# Altium project R3D903.PrjPCB
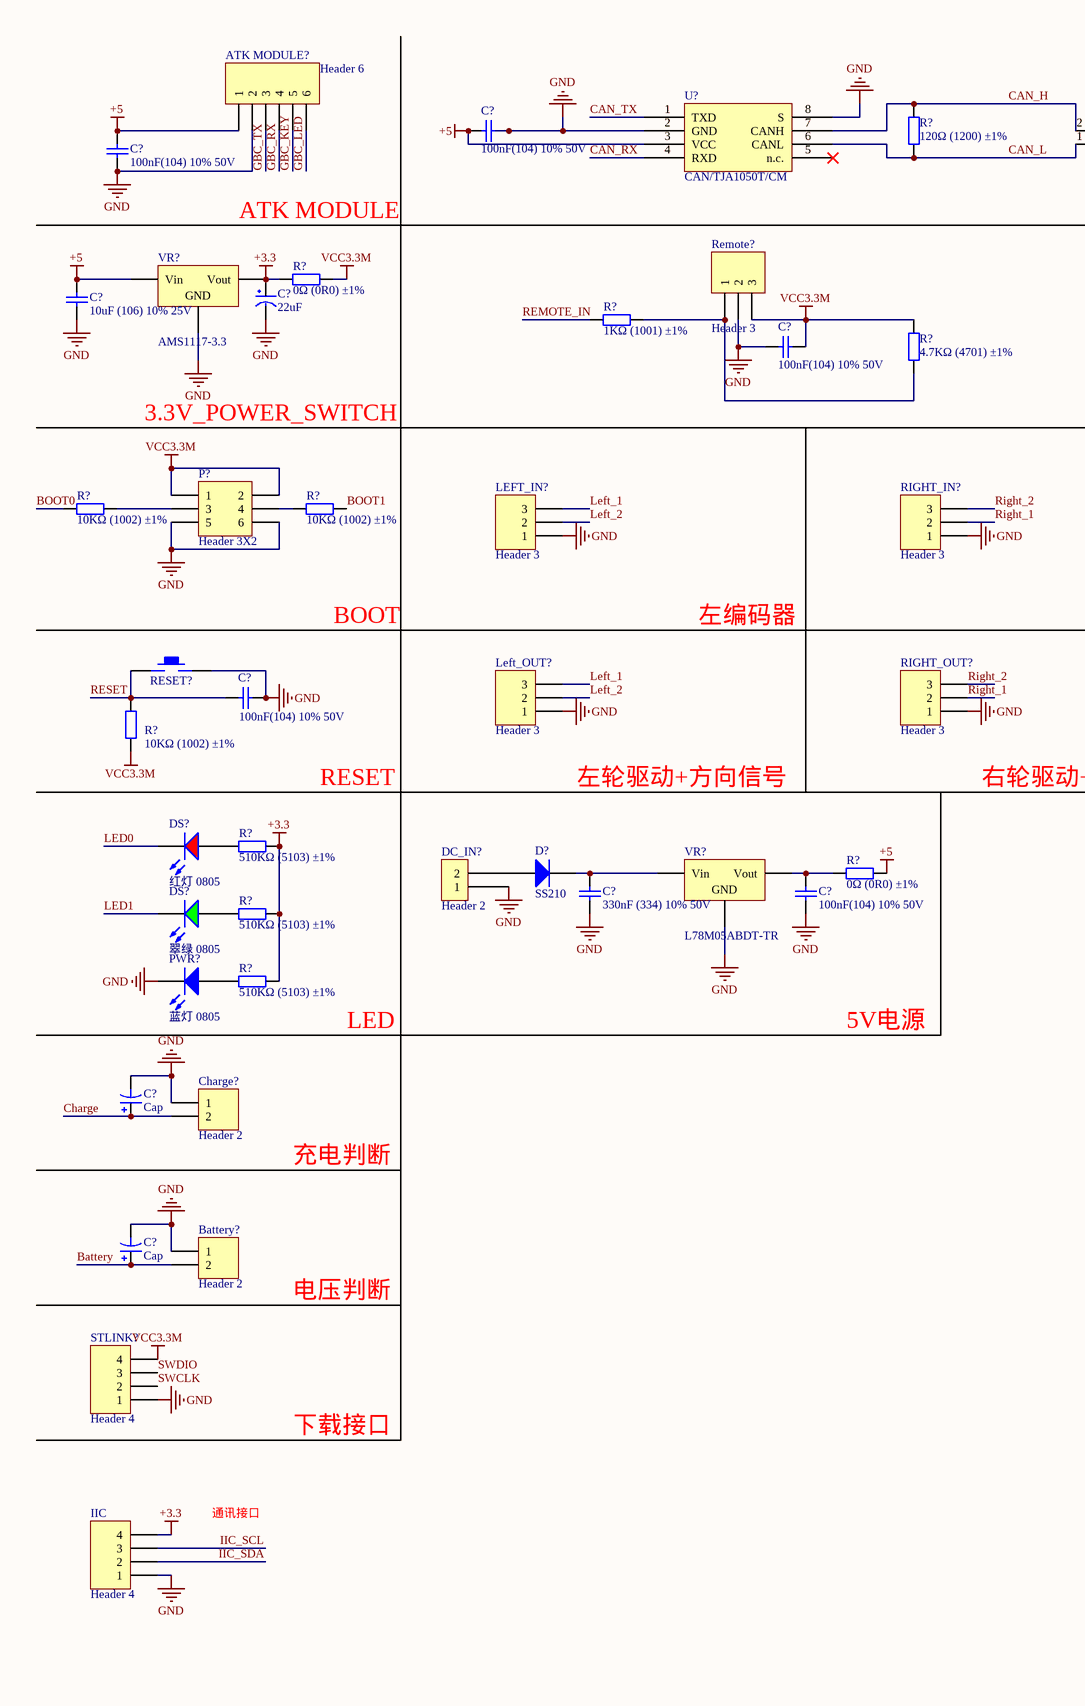
[diagram p0: D3R903.SchDoc, left]
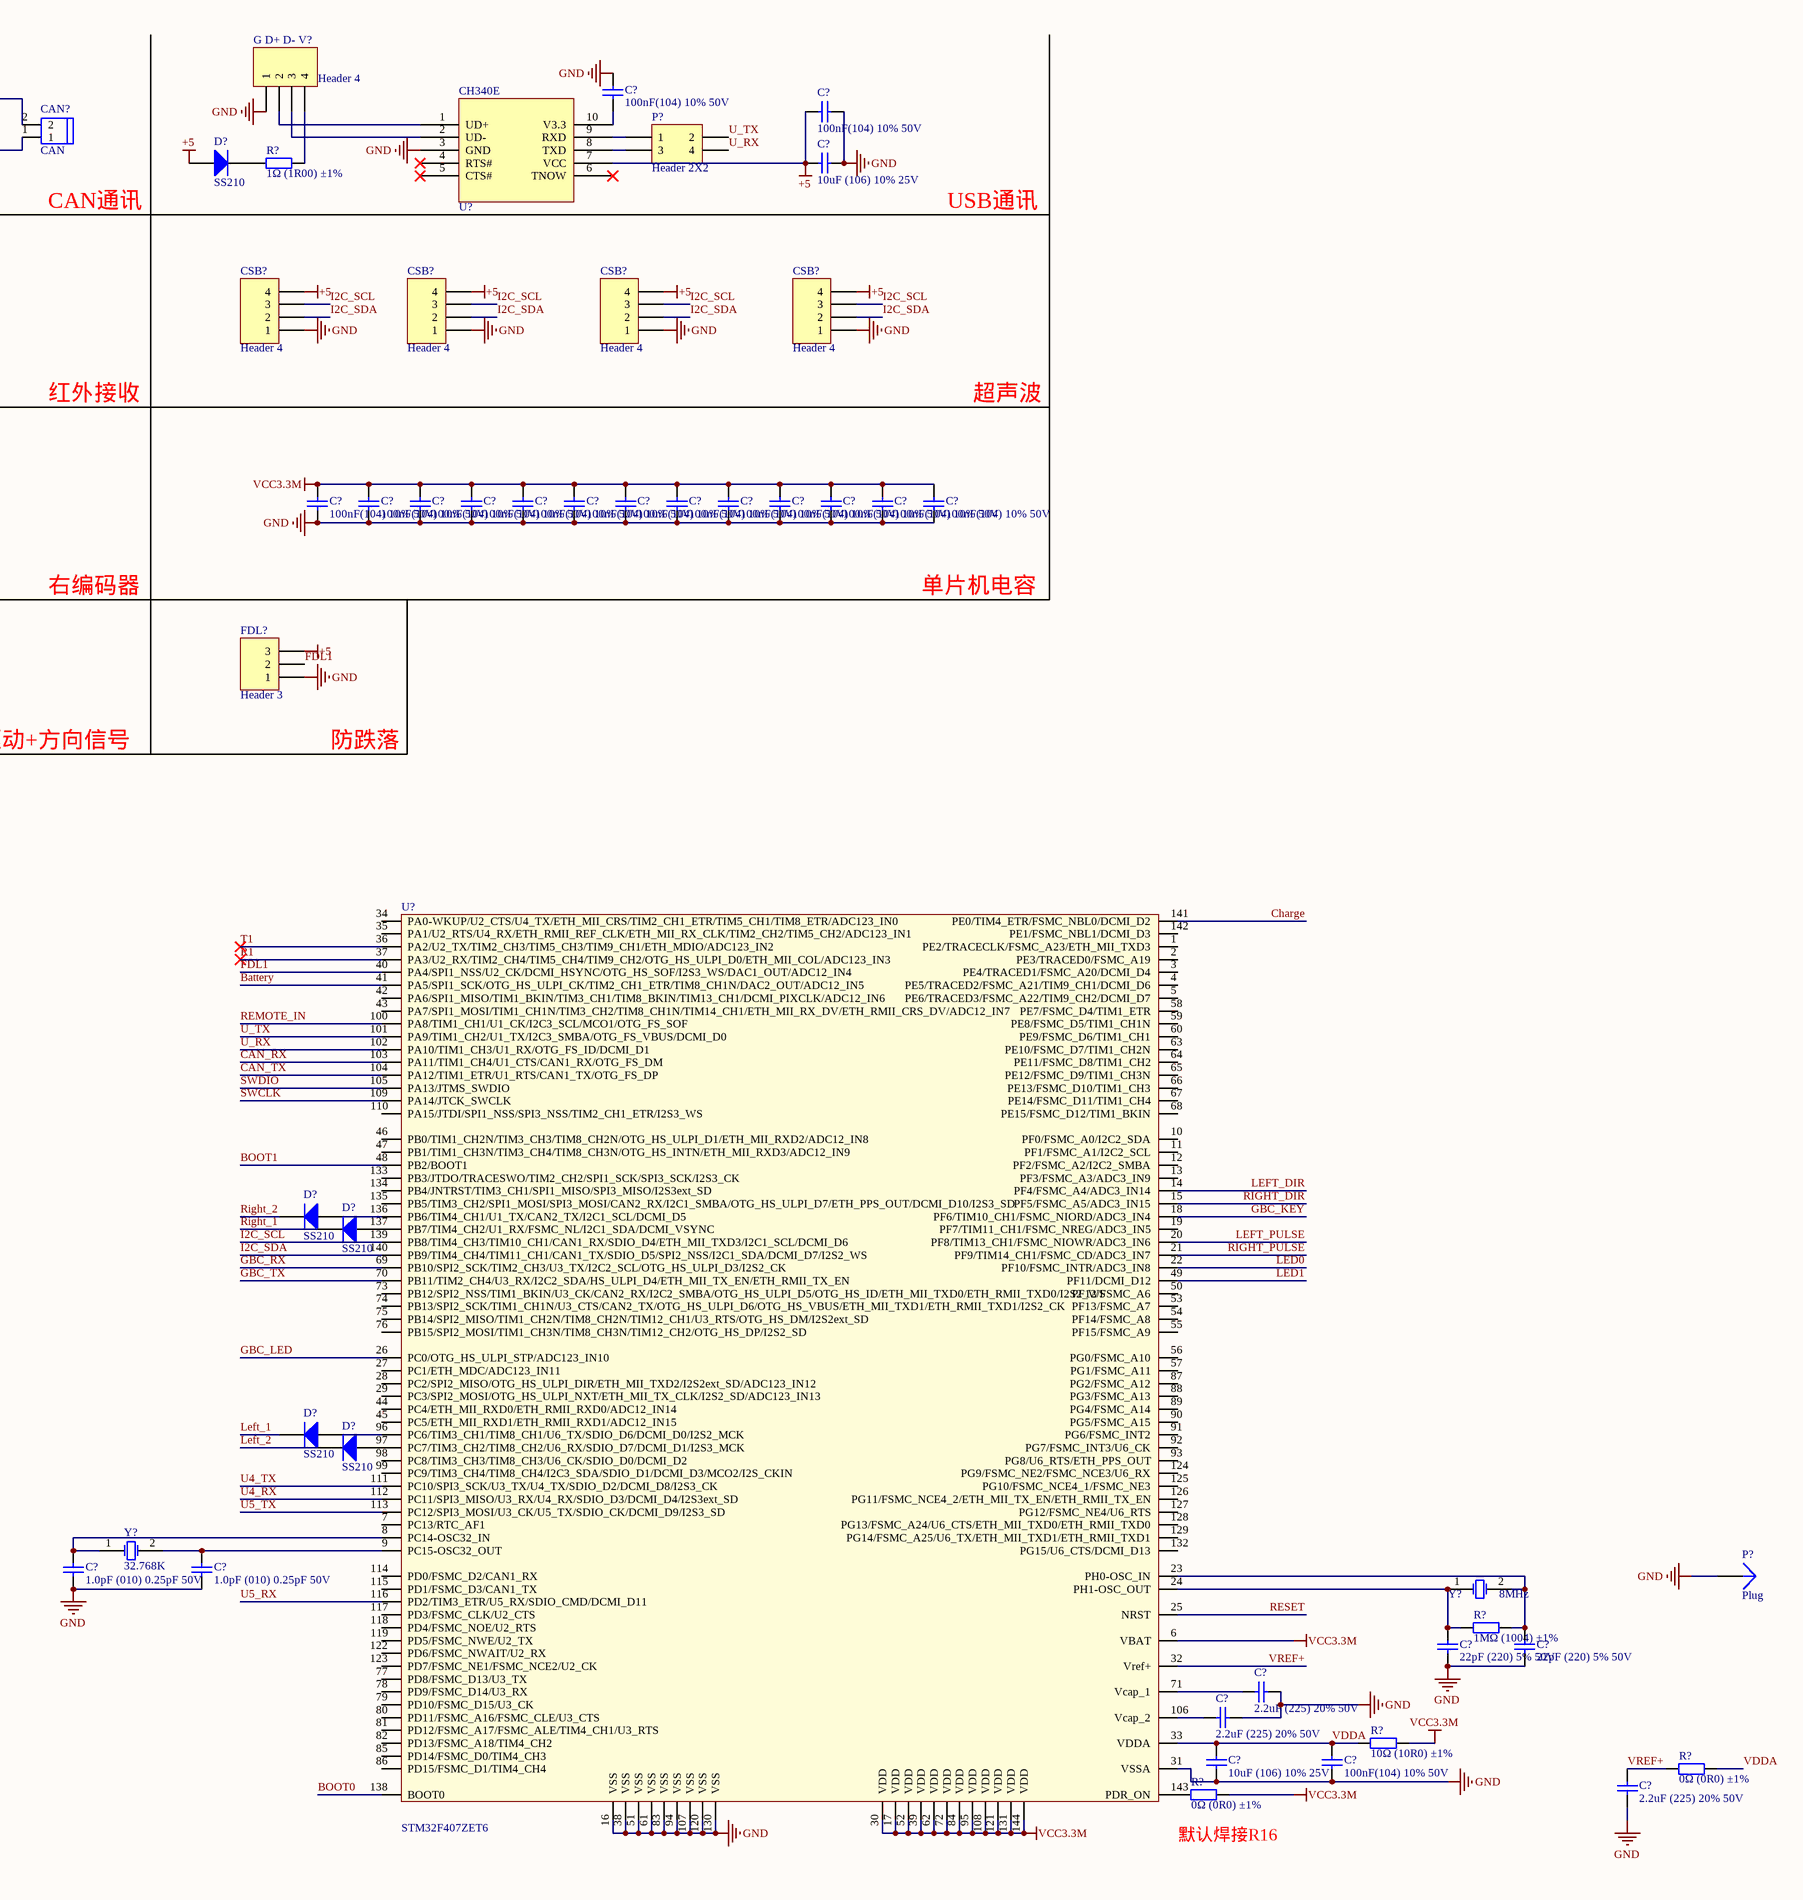
[diagram p1: D3R903.SchDoc, right]
1 sheet, 89 parts. Net scope: global (net labels, ports and power ports of the same name join across sheets).
Board file: R3D902.PcbDoc

## Sheet D3R903.SchDoc
size A1

### Parts
(Parts that share a designator on the sheet are numbered #1, #2 ... from top to bottom, then left to right.)
ATK_MODULE?  Header 6  [HDR1X6]
Battery?  Header 2  [HDR1X2]
C?#1  100nF(104) 10% 50V  [LC-0805_C]
C?#2  100nF(104) 10% 50V  [LC-0805_C]
C?#3  100nF(104) 10% 50V  [LC-0805_C]
C?#4  10uF (106) 10% 25V  [LC-0805_C]
C?#5  100nF(104) 10% 50V  [LC-0805_C]
C?#6  22uF  [CC6.56.5]
C?#7  10uF (106) 10% 25V  [LC-0805_C]
C?#8  100nF(104) 10% 50V  [LC-0805_C]
C?#9  100nF(104) 10% 50V  [LC-0805_C]
C?#10  100nF(104) 10% 50V  [LC-0805_C]
C?#11  100nF(104) 10% 50V  [LC-0805_C]
C?#12  100nF(104) 10% 50V  [LC-0805_C]
C?#13  100nF(104) 10% 50V  [LC-0805_C]
C?#14  100nF(104) 10% 50V  [LC-0805_C]
C?#15  100nF(104) 10% 50V  [LC-0805_C]
C?#16  100nF(104) 10% 50V  [LC-0805_C]
C?#17  100nF(104) 10% 50V  [LC-0805_C]
C?#18  100nF(104) 10% 50V  [LC-0805_C]
C?#19  100nF(104) 10% 50V  [LC-0805_C]
C?#20  100nF(104) 10% 50V  [LC-0805_C]
C?#21  100nF(104) 10% 50V  [LC-0805_C]
C?#22  100nF(104) 10% 50V  [LC-0805_C]
C?#23  330nF (334) 10% 50V  [LC-0805_C]
C?#24  100nF(104) 10% 50V  [LC-0805_C]
C?#25  Cap  [CAP-DIP-3.5]
C?#26  Cap  [CAP-DIP-3.5]
C?#27  1.0pF (010) 0.25pF 50V  [LC-0805_C]
C?#28  1.0pF (010) 0.25pF 50V  [LC-0805_C]
C?#29  2.2uF (225) 20% 50V  [LC-0805_C]
C?#30  22pF (220) 5% 50V  [LC-0805_C]
C?#31  22pF (220) 5% 50V  [LC-0805_C]
C?#32  2.2uF (225) 20% 50V  [LC-0805_C]
C?#33  10uF (106) 10% 25V  [LC-0805_C]
C?#34  100nF(104) 10% 50V  [LC-0805_C]
C?#35  2.2uF (225) 20% 50V  [LC-0805_C]
CAN?  CAN  [HEAD2L-0.8]
Charge?  Header 2  [HDR1X2]
CSB?#1  Header 4  [HDR1X4]
CSB?#2  Header 4  [HDR1X4]
CSB?#3  Header 4  [HDR1X4]
CSB?#4  Header 4  [HDR1X4]
D?#1  SS210  [LC-SMA(DO-214AC)_S1]
D?#2  SS210  [LC-SMA(DO-214AC)_S1]
D?#3  SS210  [LC-SMA(DO-214AC)_S1]
D?#4  SS210  [LC-SMA(DO-214AC)_S1]
D?#5  SS210  [LC-SMA(DO-214AC)_S1]
D?#6  SS210  [LC-SMA(DO-214AC)_S1]
DC_IN?  Header 2  [VH-2A - Circle Hole]
DS?#1  红灯 0805  [LC-0805_LED_S1]
DS?#2  翠绿 0805  [LC-0805_LED_S1]
FDL?  Header 3  [HDR1X3]
G_D+_D-_V?  Header 4  [HDR1X4]
IIC  Header 4  [HDR1X4]
LEFT_IN?  Header 3  [HDR1X3]
Left_OUT?  Header 3  [HDR1X3]
P?#1  Header 2X2  [HDR2X2]
P?#2  Header 3X2  [HDR2X3]
P?#3  Plug  [PIN1]
PWR?  蓝灯 0805  [LC-0805_LED_S1]
R?#1  120Ω (1200) ±1%  [LC-0805_R]
R?#2  1Ω (1R00) ±1%  [LC-0603_R]
R?#3  0Ω (0R0) ±1%  [LC-0603_R]
R?#4  1KΩ (1001) ±1%  [LC-0805_R]
R?#5  4.7KΩ (4701) ±1%  [LC-0805_R]
R?#6  10KΩ (1002) ±1%  [LC-0805_R]
R?#7  10KΩ (1002) ±1%  [LC-0805_R]
R?#8  10KΩ (1002) ±1%  [LC-0805_R]
R?#9  510KΩ (5103) ±1%  [LC-0805_R]
R?#10  0Ω (0R0) ±1%  [LC-0603_R]
R?#11  510KΩ (5103) ±1%  [LC-0805_R]
R?#12  510KΩ (5103) ±1%  [LC-0805_R]
R?#13  1MΩ (1004) ±1%  [LC-0805_R]
R?#14  10Ω (10R0) ±1%  [LC-0805_R]
R?#15  0Ω (0R0) ±1%  [LC-0603_R]
R?#16  0Ω (0R0) ±1%  [LC-0603_R]
Remote?  Header 3  [HDR1X3]
RESET?  KEY_M  [KEY_M]  (value not drawn)
RIGHT_IN?  Header 3  [HDR1X3]
RIGHT_OUT?  Header 3  [HDR1X3]
STLINK?  Header 4  [HDR1X4]
U?#1  CAN/TJA1050T/CM  [LC-SOIC-8_150mil]
U?#2  CH340E  [LC-MSOP-10]  (value not drawn)
U?#3  STM32F407ZET6  [LQFP144]
VR?#1  AMS1117-3.3  [LC-SOT-223]
VR?#2  L78M05ABDT-TR  [LC-TO-252-2-180]
Y?#1  32.768K  [R38]
Y?#2  8MHz  [XTAL_US]

### Nets
+3.3: C?#6.1(VCC) IIC.4 R?#3.1 R?#9.2 R?#11.2 R?#12.2 VR?#1.2(Vout)
+5: ATK_MODULE?.1 C?#1.1 C?#2.1 C?#4.1 C?#5.2 C?#7.2 CSB?#1.4 CSB?#2.4 CSB?#3.4 CSB?#4.4 D?#1.1(A) FDL?.3 R?#10.2 U?#1.3(VCC) U?#2.7(VCC) VR?#1.3(Vin)
GND: ATK_MODULE?.2 Battery?.1 C?#1.2 C?#2.2 C?#3.2 C?#4.2 C?#5.1 C?#6.2(GND) C?#7.1 C?#8.1 C?#9.2 C?#10.2 C?#11.2 C?#12.2 C?#13.2 C?#14.2 C?#15.2 C?#16.2 C?#17.2 C?#18.2 C?#19.2 C?#20.2 C?#21.2 C?#22.1 C?#23.1 C?#24.1 C?#25.2 C?#26.2 C?#27.1 C?#28.1 C?#29.2 C?#30.1 C?#31.1 C?#32.2 C?#33.1 C?#34.1 C?#35.1 Charge?.1 CSB?#1.1 CSB?#2.1 CSB?#3.1 CSB?#4.1 DC_IN?.1 FDL?.1 G_D+_D-_V?.1 IIC.1 LEFT_IN?.1 Left_OUT?.1 P?#2.5 P?#2.6 P?#3.1 PWR?.K Remote?.2 RESET?.2 RIGHT_IN?.1 RIGHT_OUT?.1 STLINK?.1 U?#1.2(GND) U?#1.8(S) U?#2.3(GND) U?#3.16(VSS) U?#3.31(VSSA) U?#3.38(VSS) U?#3.51(VSS) U?#3.61(VSS) U?#3.83(VSS) U?#3.94(VSS) U?#3.107(VSS) U?#3.120(VSS) U?#3.130(VSS) VR?#1.1(GND) VR?#2.2(GND)
VCC3.3M: C?#8.2 C?#9.1 C?#10.1 C?#11.1 C?#12.1 C?#13.1 C?#14.1 C?#15.1 C?#16.1 C?#17.1 C?#18.1 C?#19.1 C?#20.1 C?#21.1 P?#2.1 P?#2.2 R?#3.2 R?#5.2 R?#8.1 R?#14.2 R?#16.2 Remote?.3 STLINK?.4 U?#3.6(VBAT) U?#3.17(VDD) U?#3.30(VDD) U?#3.39(VDD) U?#3.52(VDD) U?#3.62(VDD) U?#3.72(VDD) U?#3.84(VDD) U?#3.95(VDD) U?#3.108(VDD) U?#3.121(VDD) U?#3.131(VDD) U?#3.144(VDD)
Battery: Battery?.2 C?#26.1 U?#3.41(PA5/SPI1_SCK/OTG_HS_ULPI_CK/TIM2_CH1_ETR/TIM8_CH1N/DAC2_OUT/ADC12_IN5)
BOOT0: R?#6.1 U?#3.138(BOOT0)
BOOT1: R?#7.2 U?#3.48(PB2/BOOT1)
CAN_H: CAN?.2 R?#1.2 U?#1.7(CANH)
CAN_L: CAN?.1 R?#1.1 U?#1.6(CANL)
CAN_RX: U?#1.4(RXD) U?#3.103(PA11/TIM1_CH4/U1_CTS/CAN1_RX/OTG_FS_DM)
CAN_TX: U?#1.1(TXD) U?#3.104(PA12/TIM1_ETR/U1_RTS/CAN1_TX/OTG_FS_DP)
Charge: C?#25.1 Charge?.2 U?#3.141(PE0/TIM4_ETR/FSMC_NBL0/DCMI_D2)
FDL1: FDL?.2 U?#3.40(PA4/SPI1_NSS/U2_CK/DCMI_HSYNC/OTG_HS_SOF/I2S3_WS/DAC1_OUT/ADC12_IN4)
GBC_KEY: ATK_MODULE?.5 U?#3.18(PF6/TIM10_CH1/FSMC_NIORD/ADC3_IN4)
GBC_LED: ATK_MODULE?.6 U?#3.26(PC0/OTG_HS_ULPI_STP/ADC123_IN10)
GBC_RX: ATK_MODULE?.4 U?#3.69(PB10/SPI2_SCK/TIM2_CH3/U3_TX/I2C2_SCL/OTG_HS_ULPI_D3/I2S2_CK)
GBC_TX: ATK_MODULE?.3 U?#3.70(PB11/TIM2_CH4/U3_RX/I2C2_SDA/HS_ULPI_D4/ETH_MII_TX_EN/ETH_RMII_TX_EN)
I2C_SCL: CSB?#1.3 CSB?#2.3 CSB?#3.3 CSB?#4.3 U?#3.139(PB8/TIM4_CH3/TIM10_CH1/CAN1_RX/SDIO_D4/ETH_MII_TXD3/I2C1_SCL/DCMI_D6)
I2C_SDA: CSB?#1.2 CSB?#2.2 CSB?#3.2 CSB?#4.2 U?#3.140(PB9/TIM4_CH4/TIM11_CH1/CAN1_TX/SDIO_D5/SPI2_NSS/I2C1_SDA/DCMI_D7/I2S2_WS)
IIC_SCL: IIC.3
IIC_SDA: IIC.2
LED0: DS?#1.K U?#3.22(PF10/FSMC_INTR/ADC3_IN8)
LED1: DS?#2.K U?#3.49(PF11/DCMI_D12)
Left_1: D?#5.2(K) LEFT_IN?.3 Left_OUT?.3
Left_2: D?#6.2(K) LEFT_IN?.2 Left_OUT?.2
LEFT_DIR: U?#3.14(PF4/FSMC_A4/ADC3_IN14)
LEFT_PULSE: U?#3.20(PF8/TIM13_CH1/FSMC_NIOWR/ADC3_IN6)
R1: U?#3.37(PA3/U2_RX/TIM2_CH4/TIM5_CH4/TIM9_CH2/OTG_HS_ULPI_D0/ETH_MII_COL/ADC123_IN3)
REMOTE_IN: R?#4.1 U?#3.100(PA8/TIM1_CH1/U1_CK/I2C3_SCL/MCO1/OTG_FS_SOF)
RESET: C?#22.2 R?#8.2 RESET?.1 U?#3.25(NRST)
Right_1: D?#4.2(K) RIGHT_IN?.2 RIGHT_OUT?.2
Right_2: D?#3.2(K) RIGHT_IN?.3 RIGHT_OUT?.3
RIGHT_DIR: U?#3.15(PF5/FSMC_A5/ADC3_IN15)
RIGHT_PULSE: U?#3.21(PF9/TIM14_CH1/FSMC_CD/ADC3_IN7)
SWCLK: STLINK?.2 U?#3.109(PA14/JTCK_SWCLK)
SWDIO: STLINK?.3 U?#3.105(PA13/JTMS_SWDIO)
T1: U?#3.36(PA2/U2_TX/TIM2_CH3/TIM5_CH3/TIM9_CH1/ETH_MDIO/ADC123_IN2)
U4_RX: U?#3.112(PC11/SPI3_MISO/U3_RX/U4_RX/SDIO_D3/DCMI_D4/I2S3ext_SD)
U4_TX: U?#3.111(PC10/SPI3_SCK/U3_TX/U4_TX/SDIO_D2/DCMI_D8/I2S3_CK)
U5_RX: U?#3.116(PD2/TIM3_ETR/U5_RX/SDIO_CMD/DCMI_D11)
U5_TX: U?#3.113(PC12/SPI3_MOSI/U3_CK/U5_TX/SDIO_CK/DCMI_D9/I2S3_SD)
U_RX: P?#1.4 U?#3.102(PA10/TIM1_CH3/U1_RX/OTG_FS_ID/DCMI_D1)
U_TX: P?#1.2 U?#3.101(PA9/TIM1_CH2/U1_TX/I2C3_SMBA/OTG_FS_VBUS/DCMI_D0)
VDDA: C?#33.2 C?#34.2 R?#14.1 R?#15.2 U?#3.33(VDDA)
VREF+: C?#35.2 R?#15.1 U?#3.32(Vref+)
NetC?#3_1: C?#3.1 U?#2.10(V3.3)
NetC?#23_2: C?#23.2 D?#2.2(K) VR?#2.1(Vin)
NetC?#24_2: C?#24.2 R?#10.1 VR?#2.3(Vout)
NetC?#27_2: C?#27.2 U?#3.8(PC14-OSC32_IN) Y?#1.1(OSC1)
NetC?#28_2: C?#28.2 U?#3.9(PC15-OSC32_OUT) Y?#1.2(OSC2)
NetC?#29_1: C?#29.1 U?#3.71(Vcap_1)
NetC?#30_2: C?#30.2 R?#13.1 U?#3.24(PH1-OSC_OUT) Y?#2.1(OSC1)
NetC?#31_2: C?#31.2 R?#13.2 U?#3.23(PH0-OSC_IN) Y?#2.2(OSC2)
NetC?#32_1: C?#32.1 U?#3.106(Vcap_2)
NetD?#1_2: D?#1.2(K) R?#2.1
NetD?#2_1: D?#2.1(A) DC_IN?.2
NetD?#3_1: D?#3.1(A) U?#3.136(PB6/TIM4_CH1/U1_TX/CAN2_TX/I2C1_SCL/DCMI_D5)
NetD?#4_1: D?#4.1(A) U?#3.137(PB7/TIM4_CH2/U1_RX/FSMC_NL/I2C1_SDA/DCMI_VSYNC)
NetD?#5_1: D?#5.1(A) U?#3.96(PC6/TIM3_CH1/TIM8_CH1/U6_TX/SDIO_D6/DCMI_D0/I2S2_MCK)
NetD?#6_1: D?#6.1(A) U?#3.97(PC7/TIM3_CH2/TIM8_CH2/U6_RX/SDIO_D7/DCMI_D1/I2S3_MCK)
NetDS?#1_A: DS?#1.A R?#9.1
NetDS?#2_A: DS?#2.A R?#11.1
NetG_D+_D-_V?_2: G_D+_D-_V?.2 U?#2.1(UD+)
NetG_D+_D-_V?_3: G_D+_D-_V?.3 U?#2.2(UD-)
NetG_D+_D-_V?_4: G_D+_D-_V?.4 R?#2.2
NetP?#1_1: P?#1.1 U?#2.9(RXD)
NetP?#1_3: P?#1.3 U?#2.8(TXD)
NetP?#2_3: P?#2.3 R?#6.2
NetP?#2_4: P?#2.4 R?#7.1
NetPWR?_A: PWR?.A R?#12.1
NetR?#4_2: R?#4.2 R?#5.1 Remote?.1
NetR?#16_1: R?#16.1 U?#3.143(PDR_ON)

Not connected (* = marked no-connect by the designer): U?#1 5(n.c.)*; U?#2 4(RTS#)* 5(CTS#)* 6(TNOW)*; U?#3 1(PE2/TRACECLK/FSMC_A23/ETH_MII_TXD3) 2(PE3/TRACED0/FSMC_A19) 3(PE4/TRACED1/FSMC_A20/DCMI_D4) 4(PE5/TRACED2/FSMC_A21/TIM9_CH1/DCMI_D6) 5(PE6/TRACED3/FSMC_A22/TIM9_CH2/DCMI_D7) 7(PC13/RTC_AF1) 10(PF0/FSMC_A0/I2C2_SDA) 11(PF1/FSMC_A1/I2C2_SCL) 12(PF2/FSMC_A2/I2C2_SMBA) 13(PF3/FSMC_A3/ADC3_IN9) 19(PF7/TIM11_CH1/FSMC_NREG/ADC3_IN5) 27(PC1/ETH_MDC/ADC123_IN11) 28(PC2/SPI2_MISO/OTG_HS_ULPI_DIR/ETH_MII_TXD2/I2S2ext_SD/ADC123_IN12) 29(PC3/SPI2_MOSI/OTG_HS_ULPI_NXT/ETH_MII_TX_CLK/I2S2_SD/ADC123_IN13) 34(PA0-WKUP/U2_CTS/U4_TX/ETH_MII_CRS/TIM2_CH1_ETR/TIM5_CH1/TIM8_ETR/ADC123_IN0) 35(PA1/U2_RTS/U4_RX/ETH_RMII_REF_CLK/ETH_MII_RX_CLK/TIM2_CH2/TIM5_CH2/ADC123_IN1) 42(PA6/SPI1_MISO/TIM1_BKIN/TIM3_CH1/TIM8_BKIN/TIM13_CH1/DCMI_PIXCLK/ADC12_IN6) 43(PA7/SPI1_MOSI/TIM1_CH1N/TIM3_CH2/TIM8_CH1N/TIM14_CH1/ETH_MII_RX_DV/ETH_RMII_CRS_DV/ADC12_IN7) 44(PC4/ETH_MII_RXD0/ETH_RMII_RXD0/ADC12_IN14) 45(PC5/ETH_MII_RXD1/ETH_RMII_RXD1/ADC12_IN15) 46(PB0/TIM1_CH2N/TIM3_CH3/TIM8_CH2N/OTG_HS_ULPI_D1/ETH_MII_RXD2/ADC12_IN8) 47(PB1/TIM1_CH3N/TIM3_CH4/TIM8_CH3N/OTG_HS_INTN/ETH_MII_RXD3/ADC12_IN9) 50(PF12/FSMC_A6) 53(PF13/FSMC_A7) 54(PF14/FSMC_A8) 55(PF15/FSMC_A9) 56(PG0/FSMC_A10) 57(PG1/FSMC_A11) 58(PE7/FSMC_D4/TIM1_ETR) 59(PE8/FSMC_D5/TIM1_CH1N) 60(PE9/FSMC_D6/TIM1_CH1) 63(PE10/FSMC_D7/TIM1_CH2N) 64(PE11/FSMC_D8/TIM1_CH2) 65(PE12/FSMC_D9/TIM1_CH3N) 66(PE13/FSMC_D10/TIM1_CH3) 67(PE14/FSMC_D11/TIM1_CH4) 68(PE15/FSMC_D12/TIM1_BKIN) 73(PB12/SPI2_NSS/TIM1_BKIN/U3_CK/CAN2_RX/I2C2_SMBA/OTG_HS_ULPI_D5/OTG_HS_ID/ETH_MII_TXD0/ETH_RMII_TXD0/I2S2_WS) 74(PB13/SPI2_SCK/TIM1_CH1N/U3_CTS/CAN2_TX/OTG_HS_ULPI_D6/OTG_HS_VBUS/ETH_MII_TXD1/ETH_RMII_TXD1/I2S2_CK) 75(PB14/SPI2_MISO/TIM1_CH2N/TIM8_CH2N/TIM12_CH1/U3_RTS/OTG_HS_DM/I2S2ext_SD) 76(PB15/SPI2_MOSI/TIM1_CH3N/TIM8_CH3N/TIM12_CH2/OTG_HS_DP/I2S2_SD) 77(PD8/FSMC_D13/U3_TX) 78(PD9/FSMC_D14/U3_RX) 79(PD10/FSMC_D15/U3_CK) 80(PD11/FSMC_A16/FSMC_CLE/U3_CTS) 81(PD12/FSMC_A17/FSMC_ALE/TIM4_CH1/U3_RTS) 82(PD13/FSMC_A18/TIM4_CH2) 85(PD14/FSMC_D0/TIM4_CH3) 86(PD15/FSMC_D1/TIM4_CH4) 87(PG2/FSMC_A12) 88(PG3/FSMC_A13) 89(PG4/FSMC_A14) 90(PG5/FSMC_A15) 91(PG6/FSMC_INT2) 92(PG7/FSMC_INT3/U6_CK) 93(PG8/U6_RTS/ETH_PPS_OUT) 98(PC8/TIM3_CH3/TIM8_CH3/U6_CK/SDIO_D0/DCMI_D2) 99(PC9/TIM3_CH4/TIM8_CH4/I2C3_SDA/SDIO_D1/DCMI_D3/MCO2/I2S_CKIN) 110(PA15/JTDI/SPI1_NSS/SPI3_NSS/TIM2_CH1_ETR/I2S3_WS) 114(PD0/FSMC_D2/CAN1_RX) 115(PD1/FSMC_D3/CAN1_TX) 117(PD3/FSMC_CLK/U2_CTS) 118(PD4/FSMC_NOE/U2_RTS) 119(PD5/FSMC_NWE/U2_TX) 122(PD6/FSMC_NWAIT/U2_RX) 123(PD7/FSMC_NE1/FSMC_NCE2/U2_CK) 124(PG9/FSMC_NE2/FSMC_NCE3/U6_RX) 125(PG10/FSMC_NCE4_1/FSMC_NE3) 126(PG11/FSMC_NCE4_2/ETH_MII_TX_EN/ETH_RMII_TX_EN) 127(PG12/FSMC_NE4/U6_RTS) 128(PG13/FSMC_A24/U6_CTS/ETH_MII_TXD0/ETH_RMII_TXD0) 129(PG14/FSMC_A25/U6_TX/ETH_MII_TXD1/ETH_RMII_TXD1) 132(PG15/U6_CTS/DCMI_D13) 133(PB3/JTDO/TRACESWO/TIM2_CH2/SPI1_SCK/SPI3_SCK/I2S3_CK) 134(PB4/JNTRST/TIM3_CH1/SPI1_MISO/SPI3_MISO/I2S3ext_SD) 135(PB5/TIM3_CH2/SPI1_MOSI/SPI3_MOSI/CAN2_RX/I2C1_SMBA/OTG_HS_ULPI_D7/ETH_PPS_OUT/DCMI_D10/I2S3_SD) 142(PE1/FSMC_NBL1/DCMI_D3)

### Notes on the sheet
- ATK MODULE
- CAN通讯
- USB通讯
- 3.3V_POWER_SWITCH
- 红外接收
- 超声波
- BOOT
- 左编码器
- 右编码器
- 单片机电容
- RESET
- 左轮驱动+方向信号
- 右轮驱动+方向信号
- 防跌落
- LED
- 5V电源
- 充电判断
- 电压判断
- 下载接口
- 通讯接口
- 默认焊接R16
- Title
- Size:
- Date:
- File:
- A1
- Number:
- Time:
- Revision:
- Sheet
- of

### Library data of the parts
ATK_MODULE? = Header 6: Header, 6-Pin; LatestRevisionDate: 17-Jul-2002; LatestRevisionNote: Re-released for DXP Platform.; Publisher: Altium Limited
Battery? Charge? = Header 2: Header, 2-Pin; LatestRevisionDate: 17-Jul-2002; LatestRevisionNote: Re-released for DXP Platform.; Publisher: Altium Limited
C?#1-C?#3 C?#5 C?#8-C?#22 C?#24 C?#34 = 0805 100nF(104) 10% 50V: 贴片电容; ComponentLink1Description: 供应商链接; ComponentLink1URL: http://www.szlcsc.com/product/details_50686.html; Package: 0805; Supplier: LC; SuppliersPartNumber: C49678
C?#4 C?#7 C?#33 = 0805 10uF (106) 10% 25V: 贴片电容; ComponentLink1Description: 供应商链接; ComponentLink1URL: http://www.szlcsc.com/product/details_16532.html; Package: 0805; Supplier: LC; SuppliersPartNumber: C15850
C?#6 = CAP
C?#23 = 0805 330nF (334) 10% 50V: 贴片电容; ComponentLink1Description: 供应商链接; ComponentLink1URL: http://www.szlcsc.com/product/details_2092.html; Package: 0805; Supplier: LC; SuppliersPartNumber: C1740
C?#25 C?#26 = Cap_DIP
C?#27 C?#28 = 0805 1.0pF (010) 0.25pF 50V: 贴片电容; ComponentLink1Description: 供应商链接; ComponentLink1URL: http://www.szlcsc.com/product/details_15644.html; Package: 0805; Supplier: LC; SuppliersPartNumber: C14971
C?#29 C?#32 C?#35 = 0805 2.2uF (225) 20% 50V: 贴片电容; ComponentLink1Description: 供应商链接; ComponentLink1URL: http://www.szlcsc.com/product/details_50225.html; Package: 0805; Supplier: LC; SuppliersPartNumber: C49217
C?#30 C?#31 = 0805 22pF (220) 5% 50V: 贴片电容; ComponentLink1Description: 供应商链接; ComponentLink1URL: http://www.szlcsc.com/product/details_2156.html; Package: 0805; Supplier: LC; SuppliersPartNumber: C1804
CAN? = HEAD2
CSB?#1-CSB?#4 G_D+_D-_V? IIC STLINK? = Header 4: Header, 4-Pin; LatestRevisionDate: 17-Jul-2002; LatestRevisionNote: Re-released for DXP Platform.; Publisher: Altium Limited
D?#1-D?#6 = SMA(DO-214AC) SS210: 二极管; ComponentLink1Description: 供应商链接; ComponentLink1URL: http://www.szlcsc.com/product/details_15669.html; Package: SMA(DO-214AC); Supplier: LC; SuppliersPartNumber: C14996
DC_IN? = Header 2: 贴片2p座
DS?#1 = 0805 红灯: 发光二极管; ComponentLink1Description: 供应商链接; ComponentLink1URL: http://www.szlcsc.com/product/details_2668.html; Package: 0805; Supplier: LC; SuppliersPartNumber: C2295
DS?#2 = 0805 翠绿: 发光二极管; ComponentLink1Description: 供应商链接; ComponentLink1URL: http://www.szlcsc.com/product/details_2670.html; Package: 0805; Supplier: LC; SuppliersPartNumber: C2297
FDL? LEFT_IN? Left_OUT? Remote? RIGHT_IN? RIGHT_OUT? = Header 3: Header, 3-Pin; LatestRevisionDate: 17-Jul-2002; LatestRevisionNote: Re-released for DXP Platform.; Publisher: Altium Limited
P?#1 = Header 2X2: Header, 2-Pin, Dual row; LatestRevisionDate: 17-Jul-2002; LatestRevisionNote: Re-released for DXP Platform.; Publisher: Altium Limited
P?#2 = Header 3X2: Header, 3-Pin, Dual row; LatestRevisionDate: 17-Jul-2002; LatestRevisionNote: Re-released for DXP Platform.; Publisher: Altium Limited
PWR? = 0805 蓝灯: 发光二极管; ComponentLink1Description: 供应商链接; ComponentLink1URL: http://www.szlcsc.com/product/details_2666.html; Package: 0805; Supplier: LC; SuppliersPartNumber: C2293
R?#1 = 0805 120Ω (1200) 1%: 贴片电阻; ComponentLink1Description: 供应商链接; ComponentLink1URL: http://www.szlcsc.com/product/details_18125.html; Package: 0805; Supplier: LC; SuppliersPartNumber: C17437
R?#2 = 0603 1Ω (1R00) 1%: 贴片电阻; ComponentLink1Description: 供应商链接; ComponentLink1URL: http://www.szlcsc.com/product/details_23663.html; Package: 0603; Supplier: LC; SuppliersPartNumber: C22936
R?#3 R?#10 R?#15 R?#16 = 0603 0Ω (0R0) 1%: 贴片电阻; ComponentLink1Description: 供应商链接; ComponentLink1URL: http://www.szlcsc.com/product/details_21903.html; Package: 0603; Supplier: LC; SuppliersPartNumber: C21189
R?#4 = 0805 1KΩ (1001) 1%: 贴片电阻; ComponentLink1Description: 供应商链接; ComponentLink1URL: http://www.szlcsc.com/product/details_18201.html; Package: 0805; Supplier: LC; SuppliersPartNumber: C17513
R?#5 = 0805 4.7KΩ (4701) 1%: 贴片电阻; ComponentLink1Description: 供应商链接; ComponentLink1URL: http://www.szlcsc.com/product/details_18361.html; Package: 0805; Supplier: LC; SuppliersPartNumber: C17673
R?#6-R?#8 = 0805 10KΩ (1002) 1%: 贴片电阻; ComponentLink1Description: 供应商链接; ComponentLink1URL: http://www.szlcsc.com/product/details_18102.html; Package: 0805; Supplier: LC; SuppliersPartNumber: C17414
R?#9 R?#11 R?#12 = 0805 510KΩ (5103) 1%: 贴片电阻; ComponentLink1Description: 供应商链接; ComponentLink1URL: http://www.szlcsc.com/product/details_18421.html; Package: 0805; Supplier: LC; SuppliersPartNumber: C17733
R?#13 = 0805 1MΩ (1004) 1%: 贴片电阻; ComponentLink1Description: 供应商链接; ComponentLink1URL: http://www.szlcsc.com/product/details_18202.html; Package: 0805; Supplier: LC; SuppliersPartNumber: C17514
R?#14 = 0805 10Ω (10R0) 1%: 贴片电阻; ComponentLink1Description: 供应商链接; ComponentLink1URL: http://www.szlcsc.com/product/details_18103.html; Package: 0805; Supplier: LC; SuppliersPartNumber: C17415
U?#1 = CAN/TJA1050T/CM: CAN; ComponentLink1Description: 供应商链接; ComponentLink1URL: http://www.szlcsc.com/product/details_7424.html; Package: SOIC-8_150mil; Supplier: LC; SuppliersPartNumber: C6952
U?#2 = CH340E: USB; ComponentLink1Description: 供应商链接; ComponentLink1URL: http://www.szlcsc.com/product/details_14927.html; Package: SOIC-16_150mil; Supplier: LC; SuppliersPartNumber: C14267
VR?#1 = SOT-223 AMS1117-3.3: 低压差线性稳压(LDO); ComponentLink1Description: 供应商链接; ComponentLink1URL: http://www.szlcsc.com/product/details_6652.html; Package: SOT-223; Supplier: LC; SuppliersPartNumber: C6186
VR?#2 = TO-252-2 L78M05ABDT-TR: 低压差线性稳压(LDO); ComponentLink1Description: 供应商链接; ComponentLink1URL: http://www.szlcsc.com/product/details_59107.html; Package: TO-252-2; Supplier: LC; SuppliersPartNumber: C58069
Y?#1 Y?#2 = XTAL: Crystal Oscillator; Published: 8-Jun-2000; LatestRevisionDate: 17-Jul-2002; LatestRevisionNote: Re-released for DXP Platform.; Publisher: Altium Limited
  Y?#1: PackageReference: R38; PackageDescription: Crystal, Thru-Hole; 2 Leads; Body 3.1 x 8.2 mm (Dia.xH)
P?#3 = Plug: LatestRevisionDate: 17-Jul-2002; LatestRevisionNote: Re-released for DXP Platform.; Publisher: Altium Limited